# Altium schematic sheet UperFetController.SchDoc
size A4
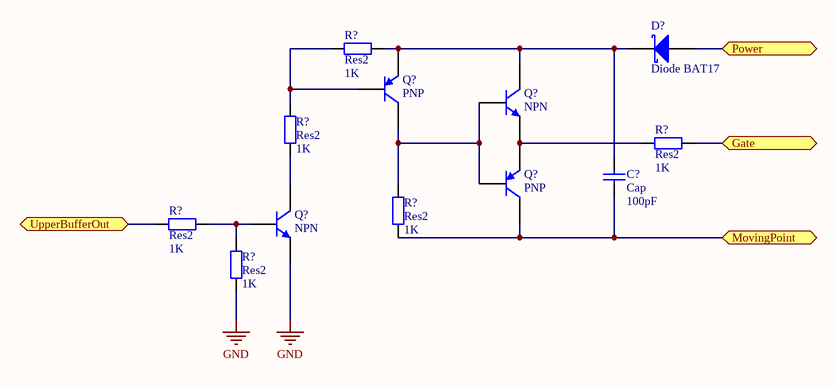
[diagram p0: UperFetController.SchDoc]

## Parts
(Parts that share a designator on the sheet are numbered #1, #2 ... from top to bottom, then left to right.)
C?  Cap  value 100pF  [RAD-0.3]
D?  Diode BAT17  [SOT-23_N]
Q?#1  PNP  [SOT-23B_N]
Q?#2  NPN  [TO-226-AA]
Q?#3  PNP  [SOT-23B_N]
Q?#4  NPN  [TO-226-AA]
R?#1  Res2  value 1K  [AXIAL-0.4]
R?#2  Res2  value 1K  [AXIAL-0.4]
R?#3  Res2  value 1K  [AXIAL-0.4]
R?#4  Res2  value 1K  [AXIAL-0.4]
R?#5  Res2  value 1K  [AXIAL-0.4]
R?#6  Res2  value 1K  [AXIAL-0.4]

## Ports
Gate (bidir), MovingPoint (bidir), Power (bidir), UpperBufferOut

## Nets
GND: Q?#4.3(E) R?#6.1
Gate: R?#2.2 ; port Gate
MovingPoint: C?.1 Q?#3.1(C) R?#4.1 ; port MovingPoint
Power: D?.1(A) ; port Power
UpperBufferOut: R?#5.2 ; port UpperBufferOut
NetC?_2: C?.2 D?.3(K) Q?#1.3(E) Q?#2.1(C) R?#1.1
NetQ?#1_1: Q?#1.1(C) Q?#2.2(B) Q?#3.2(B) R?#4.2
NetQ?#1_2: Q?#1.2(B) R?#1.2 R?#3.2
NetQ?#2_3: Q?#2.3(E) Q?#3.3(E) R?#2.1
NetQ?#4_1: Q?#4.1(C) R?#3.1
NetQ?#4_2: Q?#4.2(B) R?#5.1 R?#6.2

## Library data of the parts
C? = Cap: Capacitor; Published: 8-Jun-2000; LatestRevisionDate: 17-Jul-2002; LatestRevisionNote: Re-released for DXP Platform.; PackageReference: RAD-0.3; Publisher: Altium Limited; PackageDescription: Radial Cap, Thru-Hole; 2 Leads; 0.3 in Pin Spacing
D? = Diode BAT17: Silicon RF Schottky Diode for Mixer Applications in the VHF/UHF Range; Note: Pin 2 is not connected and not drawn.; Published: 21-Mar-2003; LatestRevisionDate: 29-May-2009; LatestRevisionNote: IPC-7351 Footprint Added.; DatasheetVersion: Oct-1999; PackageVersion: Sep-2001; PackageReference: SOT-23; Publisher: Altium Limited; PackageDescription: 3-Pin SOT-23 Package 0.95 mm Pitch, 2.5 mm Lead Span; ComponentLink1Description: Manufacturer Link; ComponentLink1URL: http://www.infineon.com/; ComponentLink2Description: Datasheet; ComponentLink2URL: http://www.infineon.com/upload/Document/cmc_upload/documents/009/363/bat17series.pdf
Q?#1 Q?#3 = PNP: PNP Bipolar Transistor; Published: 8-Jun-2000; LatestRevisionDate: 29-May-2009; LatestRevisionNote: IPC-7351 Footprint Added.; PackageVersion: Aug-1999; PackageReference: SOT-23B; Publisher: Altium Limited; PackageDescription: 3-Pin SOT-23 Package 0.95 mm Pitch, 2.4 mm Lead Span
Q?#2 Q?#4 = NPN: NPN Bipolar Transistor; Published: 8-Jun-2000; LatestRevisionDate: 17-Jul-2002; LatestRevisionNote: Re-released for DXP Platform.; PackageReference: TO-226-AA; Publisher: Altium Limited; PackageDescription: TO, Flat Index; 3 In-Line, Axial Leads; Body Dia. 4.8mm; Leads 0.55 x 0.51 mm (max); Code_JEDEC: TO-226-AA
R?#1-R?#6 = Res2: Resistor; Published: 8-Jun-2000; LatestRevisionDate: 17-Jul-2002; LatestRevisionNote: Re-released for DXP Platform.; PackageReference: AXIAL-0.4; Publisher: Altium Limited; PackageDescription: Axial Device, Thru-Hole; 2 Leads; 0.4 in Pin Spacing